# Altium schematic sheet ftdi.SchDoc
size A
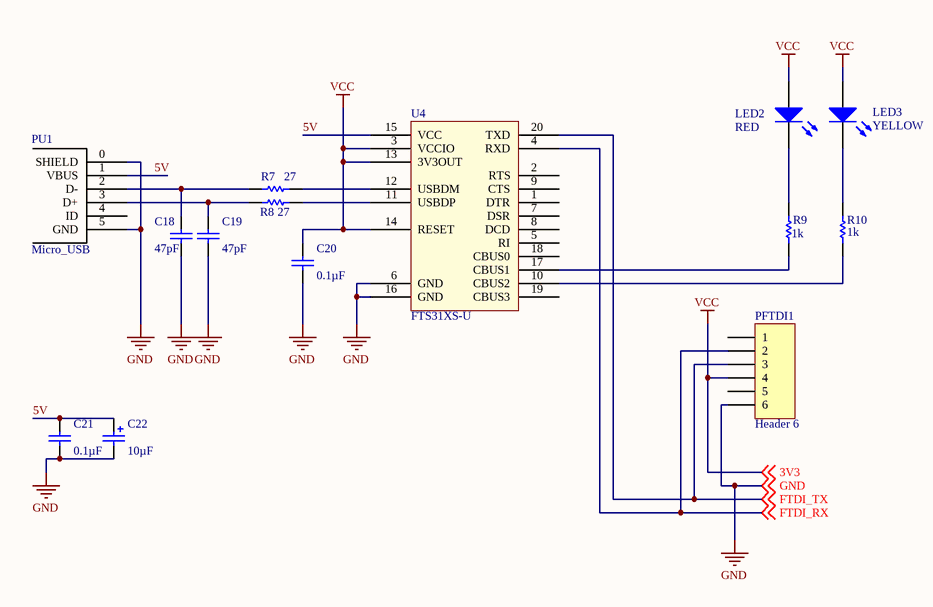
[diagram p0: ftdi.SchDoc]

## Parts
C18  value 47pF  [0805-C]  (hidden comment: Cap)
C19  value 47pF  [0805-C]  (hidden comment: Cap)
C20  value 0.1µF  [0805-C]  (hidden comment: Cap)
C21  value 0.1µF  [0805-C]  (hidden comment: Cap)
C22  value 10µF  [0805-TC]  (hidden comment: Cap Pol1)
LED2  RED  [0805-LED]
LED3  YELLOW  [0805-LED]
PFTDI1  Header 6  [HDR1X6]
PU1  Micro_USB  [Micro_USB]
R7  value 27  [0805-R]  (hidden comment: Res1)
R8  value 27  [0805-R]  (hidden comment: Res1)
R9  value 1k  [0805-R]  (hidden comment: Res1)
R10  value 1k  [0805-R]  (hidden comment: Res1)
U4  FTS31XS-U  [SOP64P570X175-20N]

## Nets
GND: C18.1 C19.1 C20.1 C21.1 C22.2 PFTDI1.6 PU1.0(SHIELD) PU1.5(GND) U4.6(GND) U4.16(GND) ; off-sheet GND
VCC: C20.2 LED2.1(A) LED3.1(A) PFTDI1.4 U4.3(VCCIO) U4.13(3V3OUT) U4.14(RESET) ; off-sheet 3V3  [also labelled 3V3]
5V: C21.2 C22.1 PU1.1(VBUS) U4.15(VCC)
FTDI_RX: PFTDI1.2 U4.4(RXD) ; off-sheet FTDI_RX
FTDI_TX: PFTDI1.3 U4.20(TXD) ; off-sheet FTDI_TX
NetC18_2: C18.2 PU1.2(D-) R7.1
NetC19_2: C19.2 PU1.3(D+) R8.1
NetLED2_2: LED2.2(K) R9.2
NetLED3_2: LED3.2(K) R10.2
NetR7_2: R7.2 U4.12(USBDM)
NetR8_2: R8.2 U4.11(USBDP)
NetR9_1: R9.1 U4.17(CBUS1)
NetR10_1: R10.1 U4.10(CBUS2)

Not connected (* = marked no-connect by the designer): PFTDI1 1 5; PU1 4(ID); U4 1(DTR) 2(RTS) 5(RI) 7(DSR) 8(DCD) 9(CTS) 18(CBUS0) 19(CBUS3)

## Library data of the parts
C18-C21 = Cap: Capacitor; Published: 8-Jun-2000; LatestRevisionDate: 17-Jul-2002; LatestRevisionNote: Re-released for DXP Platform.; PackageReference: RAD-0.3; Publisher: Altium Limited; PackageDescription: Radial Cap, Thru-Hole; 2 Leads; 0.3 in Pin Spacing
C22 = Cap Pol1: Polarized Capacitor (Radial); Published: 8-Jun-2000; LatestRevisionDate: 17-Jul-2002; LatestRevisionNote: Re-released for DXP Platform.; PackageReference: RB7.6-15; Publisher: Altium Limited; PackageDescription: Polarized Capacitor (Radial); 2 Leads
LED2 LED3 = LED2: Typical RED, GREEN, YELLOW, AMBER GaAs LED; Published: 8-Jun-2000; LatestRevisionDate: 17-Jul-2002; LatestRevisionNote: Re-released for DXP Platform.; PackageVersion: Feb-2002; PackageReference: 3.2X1.6X1.1; Publisher: Altium Limited; PackageDescription: SM LED; 2 Flat Leads
PFTDI1 = Header 6: Header, 6-Pin; LatestRevisionDate: 17-Jul-2002; LatestRevisionNote: Re-released for DXP Platform.; Publisher: Altium Limited
R7-R10 = Res1: Resistor; Published: 8-Jun-2000; LatestRevisionDate: 17-Jul-2002; LatestRevisionNote: Re-released for DXP Platform.; PackageReference: AXIAL-0.3; Publisher: Altium Limited; PackageDescription: Axial Device, Thru-Hole; 2 Leads; 0.3 in Pin Spacing